# Altium schematic sheet DB_MotherBoardConnectors.SchDoc: NB2 to Daughter Board Connectors
size A3; Organization: Altium Limited.; Address1: Level 3, 12a Rodborough Rd; Address2: Frenchs Forest 2086; Address3: NSW; Address4: AUSTRALIA; SheetNumber: 1; SheetTotal: 100; PageSetup: Record=PageOptions|CenterHorizontal=True|CenterVertical=True|PrintScale=1.01|XCorrection=1.00|YCorrection=1.00|PrintKind=0|BorderSize=5000000|LeftOffset=0|BottomOffset=0|Orientation=2|PaperLength=1000|PaperWidth=1000|Scale=100|PaperSource=7|PrintQuality=1200|MediaType=1|DitherType=10|PaperKind=A3 (297 x 420 mm)|PrintScaleMode=1
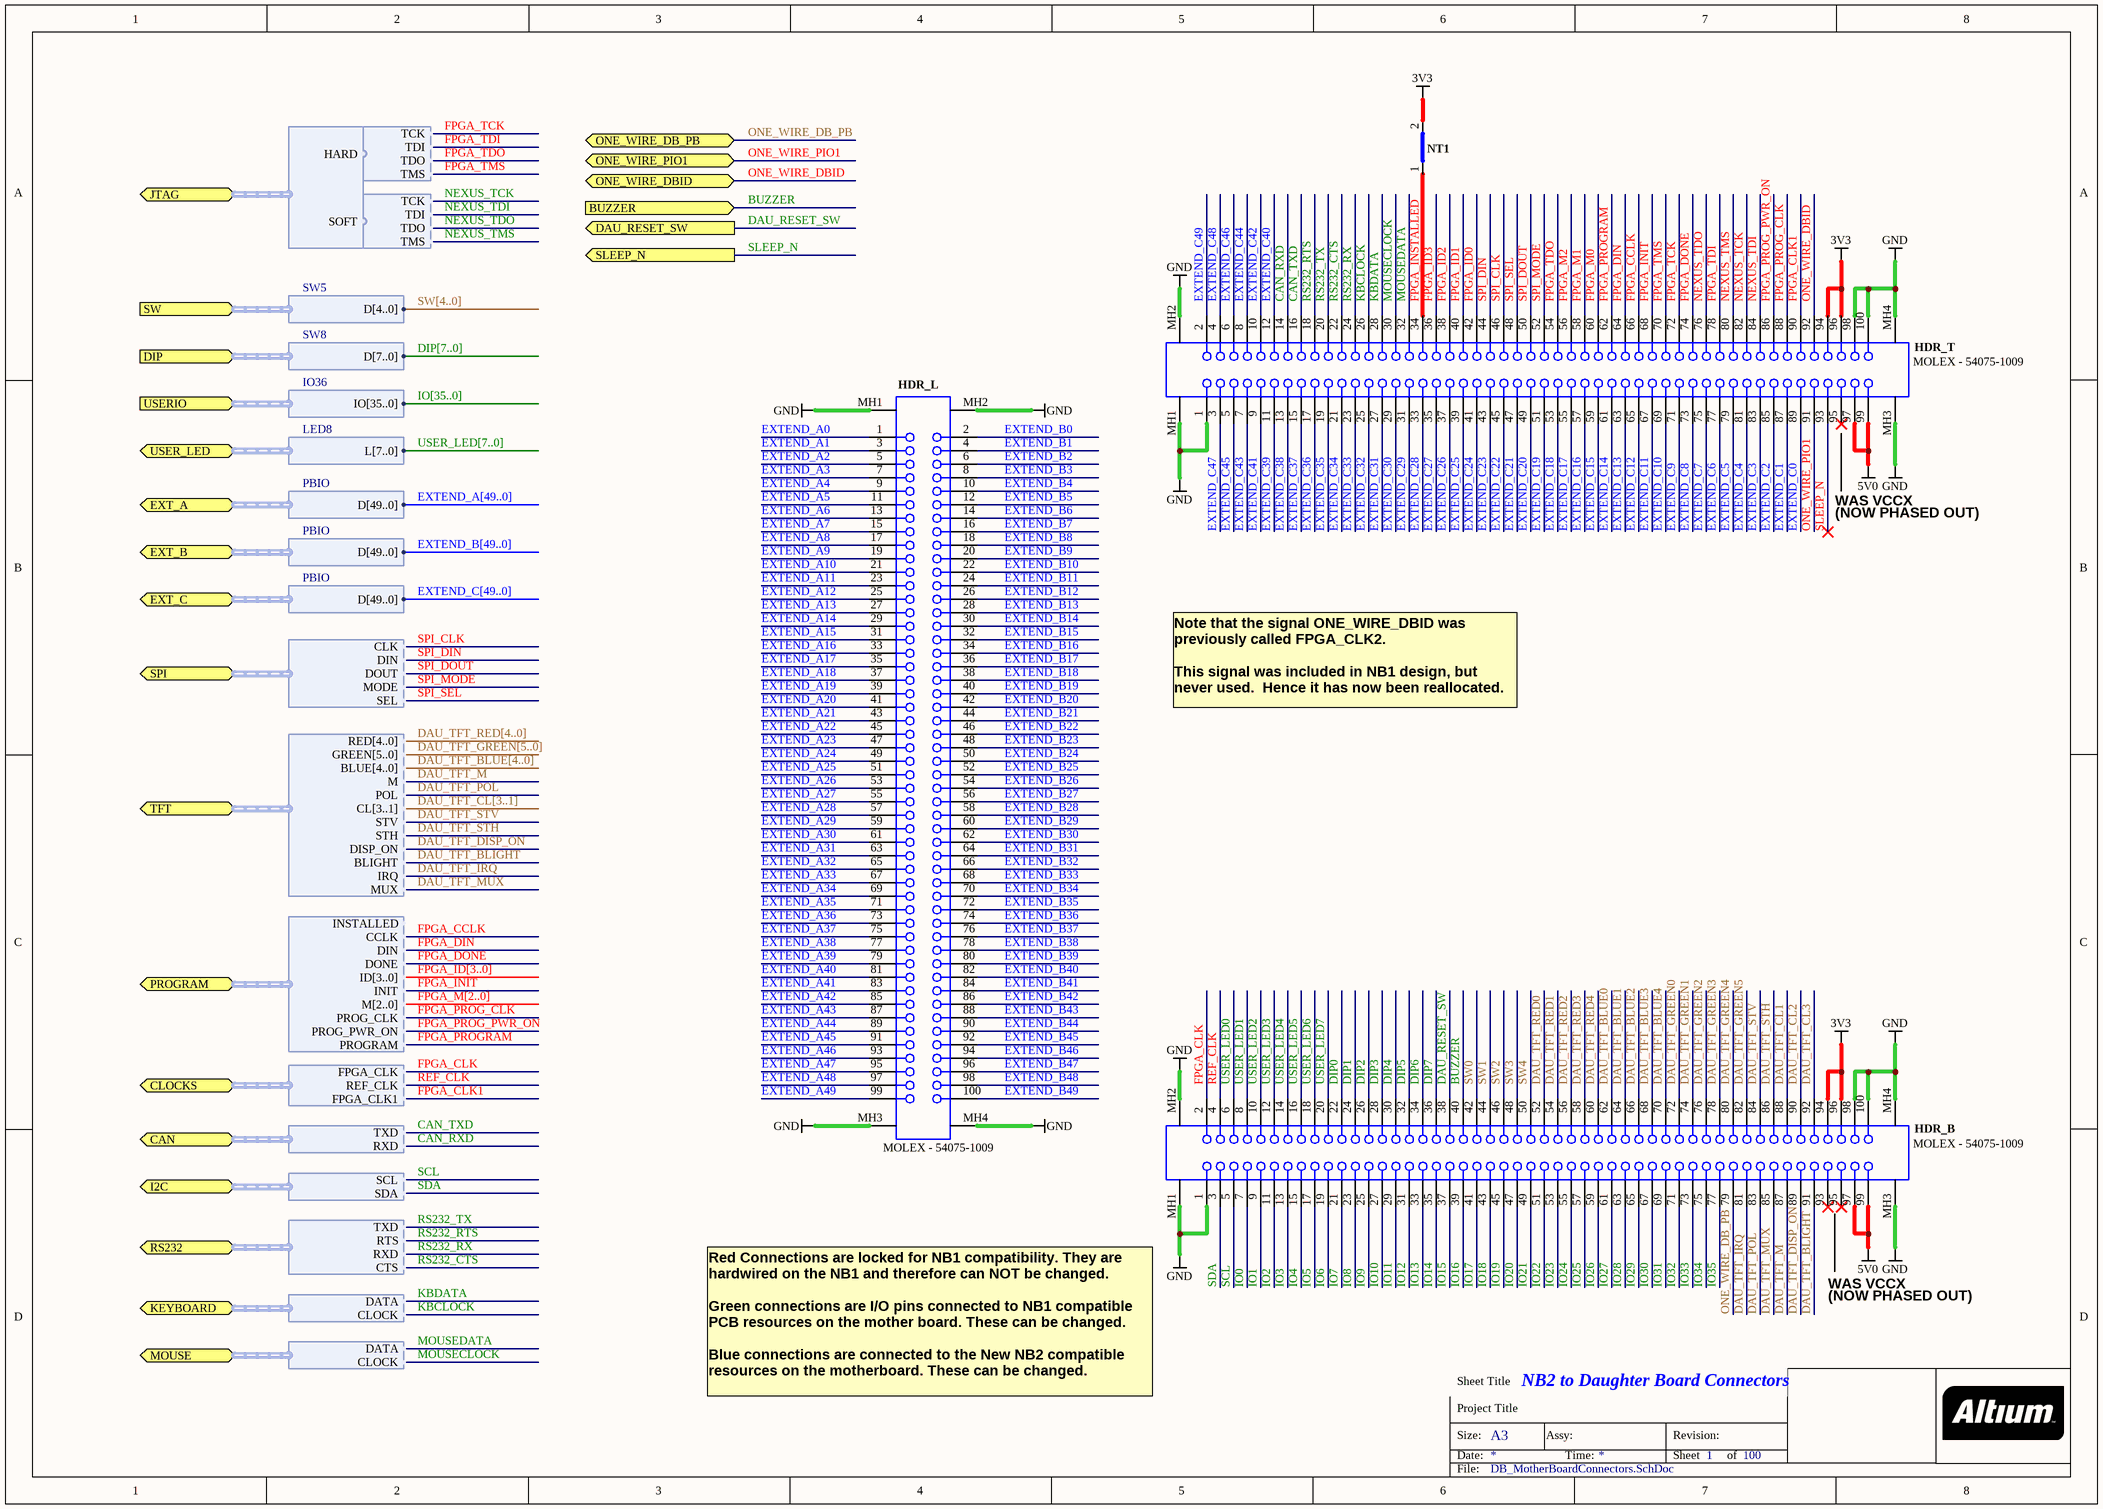
[diagram p0: DB_MotherBoardConnectors.SchDoc]

## Parts
HDR_B  MOLEX - 54075-1009  [54075]
HDR_L  MOLEX - 54075-1009  [54075]
HDR_T  MOLEX - 54075-1009  [54075]
NT1  Net Tie SMT2  [NETTIE-SMT2-8X8]  (value not drawn)  (net tie, no BOM)

## Ports
BUZZER (in), CAN (harness CAN_INT), CLOCKS (harness DAU_CLK), DAU_RESET_SW (out), DIP (harness SW8), EXT_A (harness PBIO), EXT_B (harness PBIO), EXT_C (harness PBIO), I2C (harness I2C), JTAG (harness HardSoft_JTAG), KEYBOARD (harness PS2), MOUSE (harness PS2), ONE_WIRE_DB_PB (bidir), ONE_WIRE_DBID (bidir), ONE_WIRE_PIO1 (bidir), PROGRAM (harness DAU_CTRL), RS232 (harness RS232_INT), SLEEP_N (out), SPI (harness DAU_SPI), SW (harness SW5), TFT (harness DAU_TFT), USER_LED (harness LED8), USERIO (harness IO36)

## Harnesses
JTAG: TMS, TDO, TDI, TCK
HardSoft_JTAG: HARD, SOFT
LED8: L[7..0]
IO36: IO[35..0]
SW8: D[7..0]
SW5: D[4..0]
PBIO: D[49..0]
DAU_SPI: MODE, SEL, CLK, DIN, DOUT
DAU_CLK: REF_CLK, FPGA_CLK, FPGA_CLK1
DAU_CTRL: DIN, DONE, INSTALLED, ID[3..0], CCLK, PROGRAM, M[2..0], INIT, PROG_PWR_ON, PROG_CLK
DAU_TFT: RED[4..0], GREEN[5..0], BLUE[4..0], M, POL, CL[3..1], STV, STH, DISP_ON, BLIGHT, IRQ, MUX
PS2: DATA, CLOCK
CAN_INT: TXD, RXD
I2C: SCL, SDA
RS232_INT: RXD, TXD, RTS, CTS

## Nets
3V3: HDR_B.94 HDR_B.96 HDR_T.94 HDR_T.96 NT1.2(Net2)
5V0: HDR_B.97 HDR_B.99 HDR_T.97 HDR_T.99
GND: HDR_B.1 HDR_B.98 HDR_B.100 HDR_B.MH1 HDR_B.MH2 HDR_B.MH3 HDR_B.MH4 HDR_L.MH1 HDR_L.MH2 HDR_L.MH3 HDR_L.MH4 HDR_T.1 HDR_T.98 HDR_T.100 HDR_T.MH1 HDR_T.MH2 HDR_T.MH3 HDR_T.MH4
BUZZER: HDR_B.40 ; port BUZZER
CAN_RXD: HDR_T.14 ; port CAN.RXD
CAN_TXD: HDR_T.16 ; port CAN.TXD
DAU_RESET_SW: HDR_B.38 ; port DAU_RESET_SW
DAU_TFT_BLIGHT: HDR_B.91 ; port TFT.BLIGHT
DAU_TFT_BLUE0: HDR_B.62
DAU_TFT_BLUE1: HDR_B.64
DAU_TFT_BLUE2: HDR_B.66
DAU_TFT_BLUE3: HDR_B.68
DAU_TFT_BLUE4: HDR_B.70
DAU_TFT_CL1: HDR_B.88
DAU_TFT_CL2: HDR_B.90
DAU_TFT_CL3: HDR_B.92
DAU_TFT_DISP_ON: HDR_B.89 ; port TFT.DISP_ON
DAU_TFT_GREEN0: HDR_B.72
DAU_TFT_GREEN1: HDR_B.74
DAU_TFT_GREEN2: HDR_B.76
DAU_TFT_GREEN3: HDR_B.78
DAU_TFT_GREEN4: HDR_B.80
DAU_TFT_GREEN5: HDR_B.82
DAU_TFT_IRQ: HDR_B.81 ; port TFT.IRQ
DAU_TFT_M: HDR_B.87 ; port TFT.M
DAU_TFT_MUX: HDR_B.85 ; port TFT.MUX
DAU_TFT_POL: HDR_B.83 ; port TFT.POL
DAU_TFT_RED0: HDR_B.52
DAU_TFT_RED1: HDR_B.54
DAU_TFT_RED2: HDR_B.56
DAU_TFT_RED3: HDR_B.58
DAU_TFT_RED4: HDR_B.60
DAU_TFT_STH: HDR_B.86 ; port TFT.STH
DAU_TFT_STV: HDR_B.84 ; port TFT.STV
DIP0: HDR_B.22
DIP1: HDR_B.24
DIP2: HDR_B.26
DIP3: HDR_B.28
DIP4: HDR_B.30
DIP5: HDR_B.32
DIP6: HDR_B.34
DIP7: HDR_B.36
EXTEND_A0: HDR_L.1
EXTEND_A1: HDR_L.3
EXTEND_A2: HDR_L.5
EXTEND_A3: HDR_L.7
EXTEND_A4: HDR_L.9
EXTEND_A5: HDR_L.11
EXTEND_A6: HDR_L.13
EXTEND_A7: HDR_L.15
EXTEND_A8: HDR_L.17
EXTEND_A9: HDR_L.19
EXTEND_A10: HDR_L.21
EXTEND_A11: HDR_L.23
EXTEND_A12: HDR_L.25
EXTEND_A13: HDR_L.27
EXTEND_A14: HDR_L.29
EXTEND_A15: HDR_L.31
EXTEND_A16: HDR_L.33
EXTEND_A17: HDR_L.35
EXTEND_A18: HDR_L.37
EXTEND_A19: HDR_L.39
EXTEND_A20: HDR_L.41
EXTEND_A21: HDR_L.43
EXTEND_A22: HDR_L.45
EXTEND_A23: HDR_L.47
EXTEND_A24: HDR_L.49
EXTEND_A25: HDR_L.51
EXTEND_A26: HDR_L.53
EXTEND_A27: HDR_L.55
EXTEND_A28: HDR_L.57
EXTEND_A29: HDR_L.59
EXTEND_A30: HDR_L.61
EXTEND_A31: HDR_L.63
EXTEND_A32: HDR_L.65
EXTEND_A33: HDR_L.67
EXTEND_A34: HDR_L.69
EXTEND_A35: HDR_L.71
EXTEND_A36: HDR_L.73
EXTEND_A37: HDR_L.75
EXTEND_A38: HDR_L.77
EXTEND_A39: HDR_L.79
EXTEND_A40: HDR_L.81
EXTEND_A41: HDR_L.83
EXTEND_A42: HDR_L.85
EXTEND_A43: HDR_L.87
EXTEND_A44: HDR_L.89
EXTEND_A45: HDR_L.91
EXTEND_A46: HDR_L.93
EXTEND_A47: HDR_L.95
EXTEND_A48: HDR_L.97
EXTEND_A49: HDR_L.99
EXTEND_B0: HDR_L.2
EXTEND_B1: HDR_L.4
EXTEND_B2: HDR_L.6
EXTEND_B3: HDR_L.8
EXTEND_B4: HDR_L.10
EXTEND_B5: HDR_L.12
EXTEND_B6: HDR_L.14
EXTEND_B7: HDR_L.16
EXTEND_B8: HDR_L.18
EXTEND_B9: HDR_L.20
EXTEND_B10: HDR_L.22
EXTEND_B11: HDR_L.24
EXTEND_B12: HDR_L.26
EXTEND_B13: HDR_L.28
EXTEND_B14: HDR_L.30
EXTEND_B15: HDR_L.32
EXTEND_B16: HDR_L.34
EXTEND_B17: HDR_L.36
EXTEND_B18: HDR_L.38
EXTEND_B19: HDR_L.40
EXTEND_B20: HDR_L.42
EXTEND_B21: HDR_L.44
EXTEND_B22: HDR_L.46
EXTEND_B23: HDR_L.48
EXTEND_B24: HDR_L.50
EXTEND_B25: HDR_L.52
EXTEND_B26: HDR_L.54
EXTEND_B27: HDR_L.56
EXTEND_B28: HDR_L.58
EXTEND_B29: HDR_L.60
EXTEND_B30: HDR_L.62
EXTEND_B31: HDR_L.64
EXTEND_B32: HDR_L.66
EXTEND_B33: HDR_L.68
EXTEND_B34: HDR_L.70
EXTEND_B35: HDR_L.72
EXTEND_B36: HDR_L.74
EXTEND_B37: HDR_L.76
EXTEND_B38: HDR_L.78
EXTEND_B39: HDR_L.80
EXTEND_B40: HDR_L.82
EXTEND_B41: HDR_L.84
EXTEND_B42: HDR_L.86
EXTEND_B43: HDR_L.88
EXTEND_B44: HDR_L.90
EXTEND_B45: HDR_L.92
EXTEND_B46: HDR_L.94
EXTEND_B47: HDR_L.96
EXTEND_B48: HDR_L.98
EXTEND_B49: HDR_L.100
EXTEND_C0: HDR_T.89
EXTEND_C1: HDR_T.87
EXTEND_C2: HDR_T.85
EXTEND_C3: HDR_T.83
EXTEND_C4: HDR_T.81
EXTEND_C5: HDR_T.79
EXTEND_C6: HDR_T.77
EXTEND_C7: HDR_T.75
EXTEND_C8: HDR_T.73
EXTEND_C9: HDR_T.71
EXTEND_C10: HDR_T.69
EXTEND_C11: HDR_T.67
EXTEND_C12: HDR_T.65
EXTEND_C13: HDR_T.63
EXTEND_C14: HDR_T.61
EXTEND_C15: HDR_T.59
EXTEND_C16: HDR_T.57
EXTEND_C17: HDR_T.55
EXTEND_C18: HDR_T.53
EXTEND_C19: HDR_T.51
EXTEND_C20: HDR_T.49
EXTEND_C21: HDR_T.47
EXTEND_C22: HDR_T.45
EXTEND_C23: HDR_T.43
EXTEND_C24: HDR_T.41
EXTEND_C25: HDR_T.39
EXTEND_C26: HDR_T.37
EXTEND_C27: HDR_T.35
EXTEND_C28: HDR_T.33
EXTEND_C29: HDR_T.31
EXTEND_C30: HDR_T.29
EXTEND_C31: HDR_T.27
EXTEND_C32: HDR_T.25
EXTEND_C33: HDR_T.23
EXTEND_C34: HDR_T.21
EXTEND_C35: HDR_T.19
EXTEND_C36: HDR_T.17
EXTEND_C37: HDR_T.15
EXTEND_C38: HDR_T.13
EXTEND_C39: HDR_T.11
EXTEND_C40: HDR_T.12
EXTEND_C41: HDR_T.9
EXTEND_C42: HDR_T.10
EXTEND_C43: HDR_T.7
EXTEND_C44: HDR_T.8
EXTEND_C45: HDR_T.5
EXTEND_C46: HDR_T.6
EXTEND_C47: HDR_T.3
EXTEND_C48: HDR_T.4
EXTEND_C49: HDR_T.2
FPGA_CCLK: HDR_T.66 ; port PROGRAM.CCLK
FPGA_CLK: HDR_B.2 ; port CLOCKS.FPGA_CLK
FPGA_CLK1: HDR_T.90 ; port CLOCKS.FPGA_CLK1
FPGA_DIN: HDR_T.64 ; port PROGRAM.DIN
FPGA_DONE: HDR_T.74 ; port PROGRAM.DONE
FPGA_ID0: HDR_T.42
FPGA_ID1: HDR_T.40
FPGA_ID2: HDR_T.38
FPGA_ID3: HDR_T.36
FPGA_INIT: HDR_T.68 ; port PROGRAM.INIT
FPGA_INSTALLED: HDR_T.34 NT1.1(Net1)
FPGA_M0: HDR_T.60
FPGA_M1: HDR_T.58
FPGA_M2: HDR_T.56
FPGA_PROG_CLK: HDR_T.88 ; port PROGRAM.PROG_CLK
FPGA_PROG_PWR_ON: HDR_T.86 ; port PROGRAM.PROG_PWR_ON
FPGA_PROGRAM: HDR_T.62 ; port PROGRAM.PROGRAM
FPGA_TCK: HDR_T.72 ; harness JTAG.TCK
FPGA_TDI: HDR_T.78 ; harness JTAG.TDI
FPGA_TDO: HDR_T.54 ; harness JTAG.TDO
FPGA_TMS: HDR_T.70 ; harness JTAG.TMS
IO0: HDR_B.7
IO1: HDR_B.9
IO2: HDR_B.11
IO3: HDR_B.13
IO4: HDR_B.15
IO5: HDR_B.17
IO6: HDR_B.19
IO7: HDR_B.21
IO8: HDR_B.23
IO9: HDR_B.25
IO10: HDR_B.27
IO11: HDR_B.29
IO12: HDR_B.31
IO13: HDR_B.33
IO14: HDR_B.35
IO15: HDR_B.37
IO16: HDR_B.39
IO17: HDR_B.41
IO18: HDR_B.43
IO19: HDR_B.45
IO20: HDR_B.47
IO21: HDR_B.49
IO22: HDR_B.51
IO23: HDR_B.53
IO24: HDR_B.55
IO25: HDR_B.57
IO26: HDR_B.59
IO27: HDR_B.61
IO28: HDR_B.63
IO29: HDR_B.65
IO30: HDR_B.67
IO31: HDR_B.69
IO32: HDR_B.71
IO33: HDR_B.73
IO34: HDR_B.75
IO35: HDR_B.77
KBCLOCK: HDR_T.26 ; port KEYBOARD.CLOCK
KBDATA: HDR_T.28 ; port KEYBOARD.DATA
MOUSECLOCK: HDR_T.30 ; port MOUSE.CLOCK
MOUSEDATA: HDR_T.32 ; port MOUSE.DATA
NEXUS_TCK: HDR_T.82 ; harness JTAG.TCK
NEXUS_TDI: HDR_T.84 ; harness JTAG.TDI
NEXUS_TDO: HDR_T.76 ; harness JTAG.TDO
NEXUS_TMS: HDR_T.80 ; harness JTAG.TMS
ONE_WIRE_DB_PB: HDR_B.79 ; port ONE_WIRE_DB_PB
ONE_WIRE_DBID: HDR_T.92 ; port ONE_WIRE_DBID
ONE_WIRE_PIO1: HDR_T.91 ; port ONE_WIRE_PIO1
REF_CLK: HDR_B.4 ; port CLOCKS.REF_CLK
RS232_CTS: HDR_T.22 ; port RS232.CTS
RS232_RTS: HDR_T.18 ; port RS232.RTS
RS232_RX: HDR_T.24 ; port RS232.RXD
RS232_TX: HDR_T.20 ; port RS232.TXD
SCL: HDR_B.5 ; port I2C.SCL
SDA: HDR_B.3 ; port I2C.SDA
SLEEP_N: HDR_T.93 ; port SLEEP_N
SPI_CLK: HDR_T.46 ; port SPI.CLK
SPI_DIN: HDR_T.44 ; port SPI.DIN
SPI_DOUT: HDR_T.50 ; port SPI.DOUT
SPI_MODE: HDR_T.52 ; port SPI.MODE
SPI_SEL: HDR_T.48 ; port SPI.SEL
SW0: HDR_B.42
SW1: HDR_B.44
SW2: HDR_B.46
SW3: HDR_B.48
SW4: HDR_B.50
USER_LED0: HDR_B.6
USER_LED1: HDR_B.8
USER_LED2: HDR_B.10
USER_LED3: HDR_B.12
USER_LED4: HDR_B.14
USER_LED5: HDR_B.16
USER_LED6: HDR_B.18
USER_LED7: HDR_B.20

Not connected (* = marked no-connect by the designer): HDR_B 93* 95*; HDR_T 95*

## Buses and harness runs
bus DAU_TFT_BLUE[4..0]
bus DAU_TFT_CL[3..1]
bus DAU_TFT_GREEN[5..0]
bus DAU_TFT_RED[4..0]
bus DIP[7..0]
bus EXTEND_A[49..0]
bus EXTEND_B[49..0]
bus EXTEND_C[49..0]
bus FPGA_ID[3..0]
bus FPGA_M[2..0]
bus IO[35..0]
bus SW[4..0]
bus USER_LED[7..0]

## Notes on the sheet
- WAS VCCX
- (NOW PHASED OUT)
- Note that the signal ONE_WIRE_DBID was previously called FPGA_CLK2.
  This signal was included in NB1 design, but never used.  Hence it has now been reallocated.
- Red Connections are locked for NB1 compatibility. They are hardwired on the NB1 and therefore can NOT be changed.
  Green connections are I/O pins connected to NB1 compatible PCB resources on the mother board. These can be changed.
  Blue connections are connected to the New NB2 compatible resources on the motherboard. These can be changed.
- Sheet Title
- Project Title
- Size:
- Date:
- A3
- Assy:
- Time:
- Revision:
- Sheet
- of
- File:

## Library data of the parts
HDR_B HDR_L HDR_T = D-300-0025: Connector, Molex Docking Station 100 Pin Male 54075; Connector type: MOLEX - 54075-1009; Status: Production; Category: Connector
NT1 = D-002-0002: Net-Tie, Surface Mount, 2 x 0.4mm x 0.2mm SMT Pads - For 0.2mm Track; Status: Production; Category: Net-Tie